# EAGLE design medium_h221 (EAGLE 5.07)
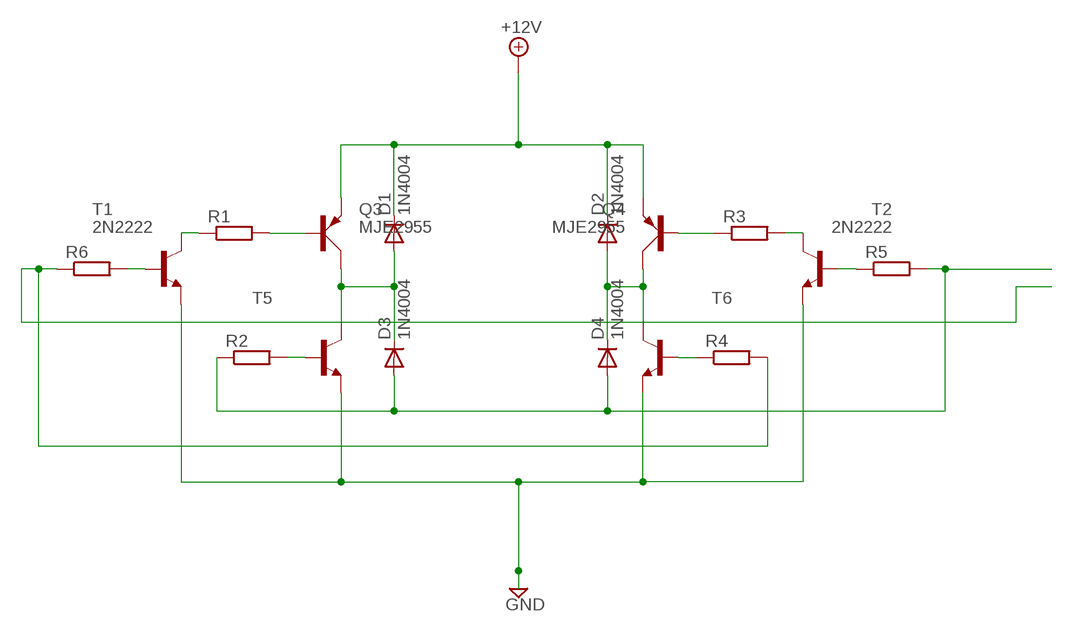
[diagram p0: schematic, sheet 1]

## Parts
D1  1N4004  [DO41-10]
D2  1N4004  [DO41-10]
D3  1N4004  [DO41-10]
D4  1N4004  [DO41-10]
Q3  MJE2955  [TO220AV]
Q4  MJE2955  [TO220AV]
R1  R-EU_0204/5  [0204/5]
R2  R-EU_0204/5  [0204/5]
R3  R-EU_0204/5  [0204/5]
R4  R-EU_0204/5  [0204/5]
R5  R-EU_0204/5  [0204/5]
R6  R-EU_0204/5  [0204/5]
T1  2N2222  [TO18]
T2  2N2222  [TO18]
T5  -NPN-TO220V  [TO220V]
T6  -NPN-TO220V  [TO220V]

## Nets
+12V: D1.C D2.C Q3.E Q4.E
GND: T1.1(E) T2.1(E) T5.3(E) T6.3(E)
N$1: R1.1 T1.3(C)
N$2: Q3.B R1.2
N$3: D2.A D4.C Q4.C T6.2(C)
N$6: R4.2 R6.1
N$7: R4.1 T6.1(B)
N$8: Q4.B R3.1
N$9: R2.2 T5.1(B)
N$10: R6.2 T1.2(B)
N$11: R5.1 T2.2(B)
N$12: R3.2 T2.3(C)
N$13: D1.A D3.C Q3.C T5.2(C)
N$15: D3.A D4.A R2.1 R5.2

## Library data of the parts
D1-D4 = diode:1N4004: DIODE general purpose rectifier, 1 A
Q3 Q4 = transistor-power:MJE2955: PNP TRANSISTOR
R1-R6 = rcl:R-EU_: RESISTOR, European symbol
T1 T2 = transistor:2N2222: NPN TRANSISTOR
T5 T6 = transistor-neu-to92:*-NPN-: NPN Transistror

## Board
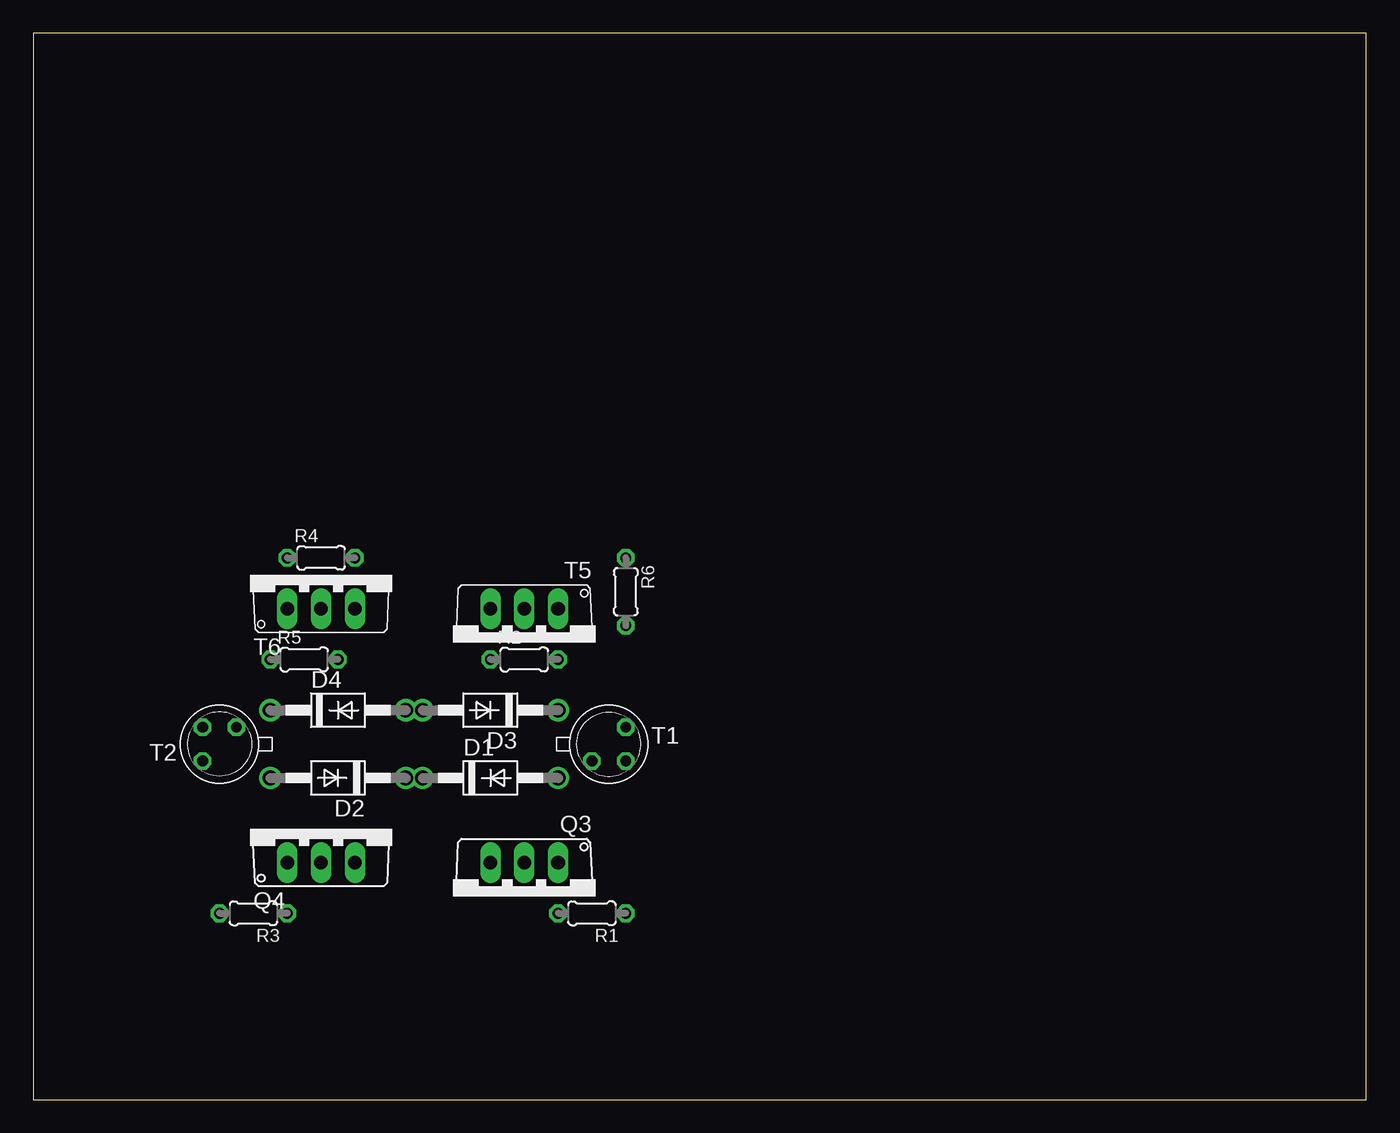
[diagram p1: board, top side]
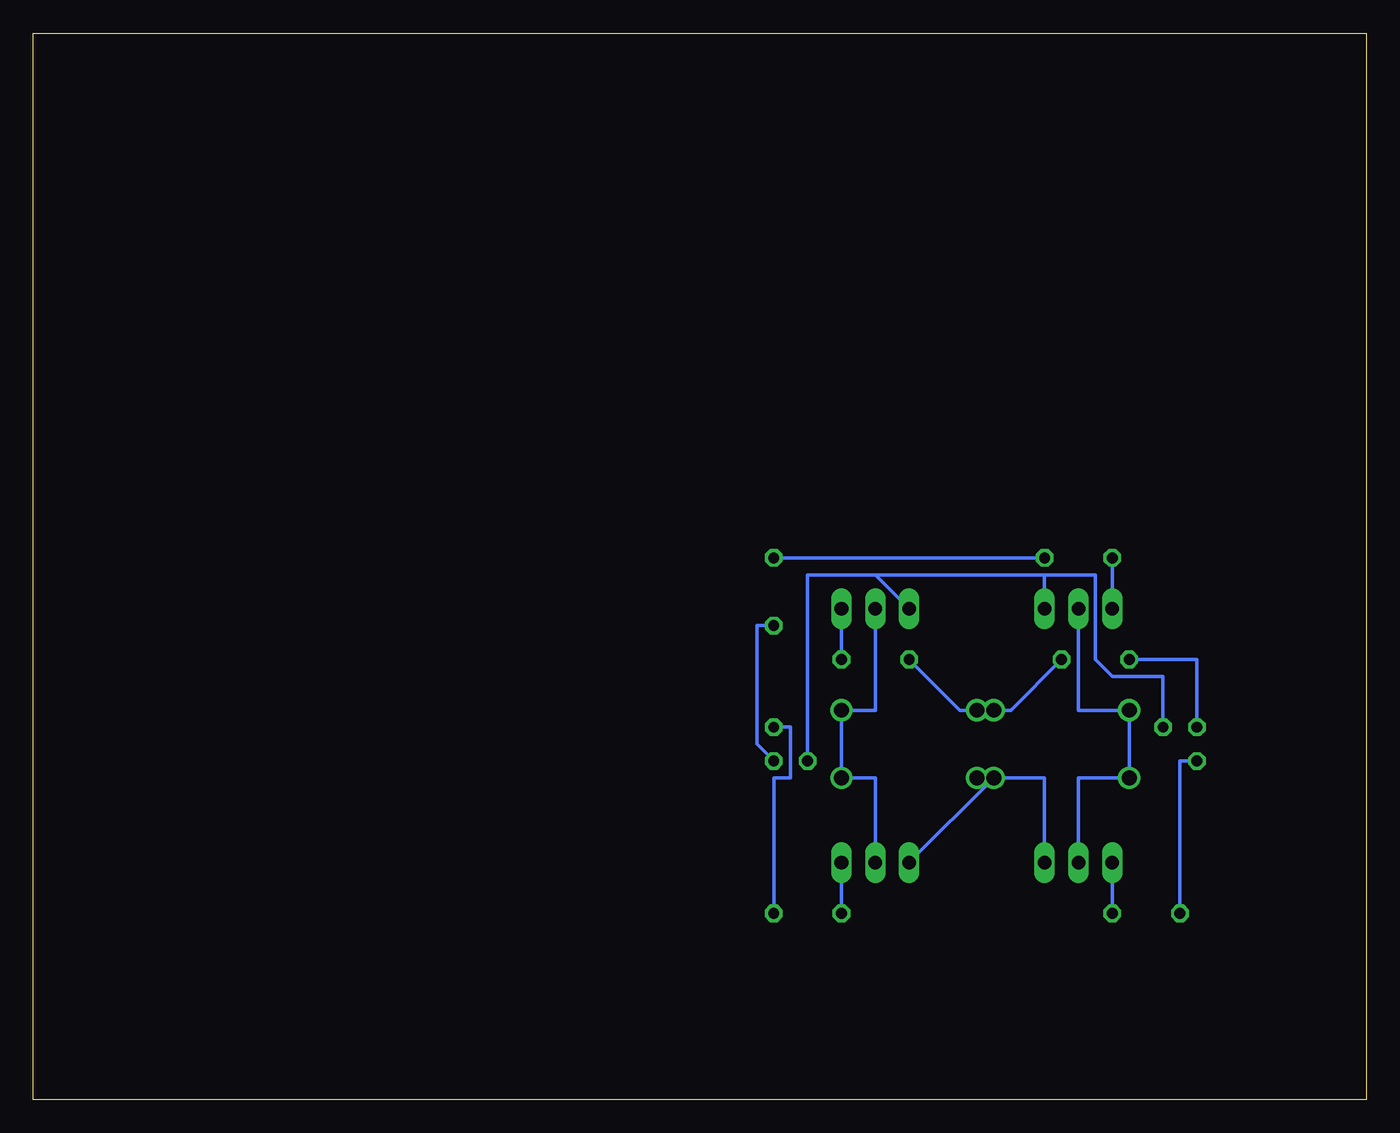
[diagram p2: board, bottom side, seen from below]

Size 100 x 80 mm. Coordinates in mm from the lower left corner, seen from the top.
Outline: 0,0 100,0 100,80 0,80 0,0
Copper layers (1*16): Top 0.035mm / dielectric 1.5mm / Bottom 0.035mm
Design rules "default": minimum track width 10mil, minimum drill 24mil, track to track 8mil, track to pad 8mil, pad to pad 8mil, via to via 8mil, smd to smd 8mil, copper to edge 40mil, drill to drill 8mil, minimum pad ring 10mil, minimum via ring 8mil, stop-mask expansion 4mil, vias tented up to drill 0mil, thermal gap 10mil

### Footprints (pad centres in the part's own frame; a part is rotated, then mirrored left to right if it is on the bottom)
DO41-10 = drill 1.118 round: A 5.08,0; C -5.08,0
TO220AV = drill 1.016 long: B -2.54,-2.54; C 0,-2.54; E 2.54,-2.54
0204/5 = drill 0.813 octagon: 1 -2.54,0; 2 2.54,0
TO18 = drill 0.813 octagon: 1 -1.27,-1.27; 2 1.27,-1.27; 3 1.27,1.27
TO220V = drill 1.016 long: 1 -2.54,-2.54; 2 0,-2.54; 3 2.54,-2.54

### Placement (x,y rotation side)
D1  34.29,24.13 0 top
D2  22.86,24.13 180 top
D3  34.29,29.21 180 top
D4  22.86,29.21 0 top
Q3  36.83,15.24 180 top
Q4  21.59,20.32 0 top
R1  41.91,13.97 180 top
R2  36.83,33.02 0 top
R3  16.51,13.97 180 top
R4  21.59,40.64 0 top
R5  20.32,33.02 0 top
R6  44.45,38.1 270 top
T1  43.18,26.67 0 top
T2  13.97,26.67 180 top
T5  36.83,34.29 180 top
T6  21.59,39.37 0 top

### Tracks (layer width: path | path; a pad name or v marks a point on that pad's centre or on a via)
+12V
  Bottom 0.254: Q4.E 24.13,24.13 D2.C | D2.C Q3.E | D2.C D1.C
GND
  Bottom 0.254: T1.1 41.91,39.37 36.83,39.37 | 36.83,39.37 T5.3 | T2.1 15.24,31.75 19.05,31.75 20.32,33.02 20.32,39.37 24.13,39.37 | 24.13,39.37 36.83,39.37 | 24.13,39.37 T6.3
N$1
  Bottom 0.254: R1.1 44.45,24.13 43.18,24.13 43.18,27.94 T1.3
N$2
  Bottom 0.254: R1.2 Q3.B
N$3
  Bottom 0.254: Q4.C 21.59,24.13 D2.A D4.C 21.59,29.21 T6.2
N$6
  Bottom 0.254: R4.2 R6.1
N$7
  Bottom 0.254: T6.1 R4.1
N$8
  Bottom 0.254: R3.1 Q4.B
N$9
  Bottom 0.254: R2.2 T5.1
N$10
  Bottom 0.254: T1.2 45.72,26.67 45.72,35.56 R6.2
N$11
  Bottom 0.254: T2.2 12.7,33.02 R5.1
N$12
  Bottom 0.254: R3.2 13.97,25.4 T2.3
N$13
  Bottom 0.254: Q3.C 36.83,24.13 D1.A D3.C 36.83,29.21 T5.2
N$15
  Bottom 0.254: R5.2 26.67,29.21 D4.A D3.A 30.48,29.21 R2.1